# Altium project Business_card.PrjPcb
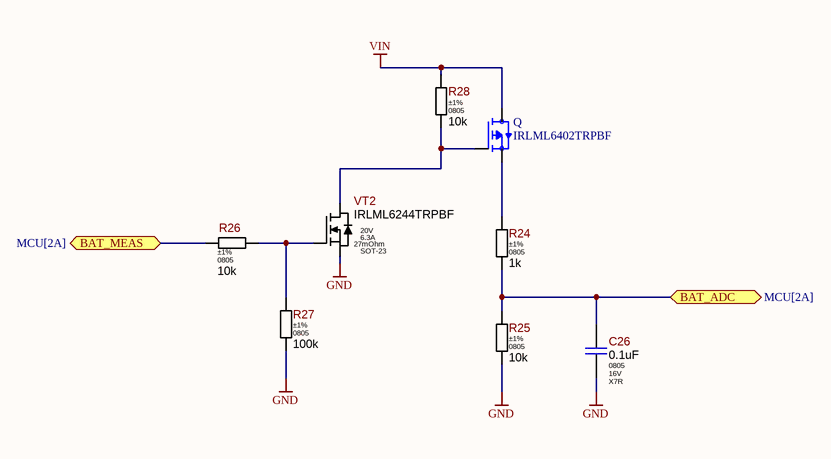
[diagram p0: BAT.SchDoc]
2 sheets, 41 parts. Net scope: flat (ports and power ports of the same name join across sheets).
Board file: PCB1.PcbDoc
Sheets:
  BAT.SchDoc
  MCU.SchDoc

## Sheet BAT.SchDoc
size A; SheetNumber: 3; SheetTotal: 4

### Parts
C26  Package: 0805  Voltage: 16V  Dielectric Type: X7R  [C0805]  (hidden comment: 0.1uF)
Q  IRLML6402TRPBF  [SOT95P237X112-3N]
R24  Tolerance: ±1%  Package: 0805  [R0805]  (hidden comment: 1k)
R25  value 10k  Tolerance: ±1%  Package: 0805  [R0805]  (hidden comment: 1M)
R26  Tolerance: ±1%  Package: 0805  [R0805]  (hidden comment: 10k)
R27  value 100k  Tolerance: ±1%  Package: 0805  [R0805]  (hidden comment: 10k)
R28  Tolerance: ±1%  Package: 0805  [R0805]  (hidden comment: 10k)
VT2  Part Number: IRLML6244TRPBF  Vds: 20V  Id: 6.3A  Rds: 27mOhm  Package: SOT-23  [IRLMT]  (hidden comment: IRLML6244)

### Ports
BAT_ADC (bidir, see MCU[2A]), BAT_MEAS (bidir, see MCU[2A])

### Nets
GND: C26.2 R25.2 R27.2 VT2.2(S)
VIN: Q.3(D) R28.1
NetC26_1: C26.1 R24.2 R25.1 ; port BAT_ADC
NetQ_1: Q.1(G) R28.2 VT2.3(D)
NetQ_2: Q.2(S) R24.1
NetR26_1: R26.1 ; port BAT_MEAS
NetR26_2: R26.2 R27.1 VT2.1(G)

### Library data of the parts
C26 = Capacitor-NonPolar: Part Number: GRM155R71C104JA88J; Manufacturer: Murata Electronics; Ajax_1C_ID: 25536; Ajax_1C_PN: 100nF 16V X7R 5% 0402 GRM155R71C104JA88J Ceramic Capacitor SMD RoHS; Standard Lead Time: 16 Weeks; Tolerance: ±5%; Replacement: NONE; Value: 0.1uF; Part Type: Ceramic / X7R / 0402; Component Type: SMD; Temperature Range: -55°C ~ 125°C; ComponentLink1URL: https://eu.mouser.com/datasheet/2/281/1/GRM155R71C104JA88_01A-1983984.pdf; Supplier 1: Mouser; Supplier Part Number 1: 81-GRM155R71C104JA8J; ComponentLink1Description: Datasheet
Q = IRLML6402TRPBF: RoHS Compliant | Industry-leading quality | Fast Switching | Low Profile _less than 1.1mm_ | P-Channel MOSFET | SOT-23 Footprint; MF: Infineon; Package: SOT-23 Infineon; Value: *; Price: None; MP: IRLML6402TRPBF; SnapEDA_Link: https://www.snapeda.com/parts/IRLML6402TRPBF/Infineon%20Technologies/view-part/523558/?ref=snap; Availability: Unavailable
R24-R28 = Resistor: 10 kOhms ±1% 1/16W 0402 Thick Film Resistor; Part Number: RC0402FR-0710KL; Manufacturer: Yageo; Ajax_1C_ID: 6717; Ajax_1C_PN: 10k 1% 0402 Resistors SMD RoHS; Power Rating: 0.062W; Voltage: 50V; Temperature Stability: ±100ppm/°C; Replacement: NONE; Component Type: SMD; Part Type: Thick Film; Temperature Range: -55°C ~ 155°C; ComponentLink1URL: https://eu.mouser.com/datasheet/2/447/PYu_RC_Group_51_RoHS_L_10-1664068.pdf; Supplier 1: Digi-Key; Supplier Part Number 1: 311-10.0KLRTR-ND; ComponentLink1Description: Datasheet
  R24: Value: 1k
  R26 R28: Value: 10k
VT2 = MOSFET-N-Channel: 20V, 6.3A max N-Channel HEXFET MOSFET, 21mOhm @ Vgs = 4.5V; Manufacturer: Infineon Technologies; Ajax_1C_ID: 5903; Ajax_1C_PN: IRLML6244TRPBF. полевой транзистор; Standard Lead Time: 15 Weeks; Replacement: NONE; Part Type: N-Channel; Component Type: SMD; Temperature Range: -55°C ~ 150°C; ComponentLink1URL: https://www.infineon.com/dgdl/irlml6244pbf.pdf?fileId=5546d462533600a4015356686fed261f; Supplier 1: Digi-Key; Supplier Part Number 1: IRLML6244TRPBFTR-ND; ComponentLink1Description: Datasheet

## Sheet MCU.SchDoc
size A; SheetNumber: 4; SheetTotal: 4
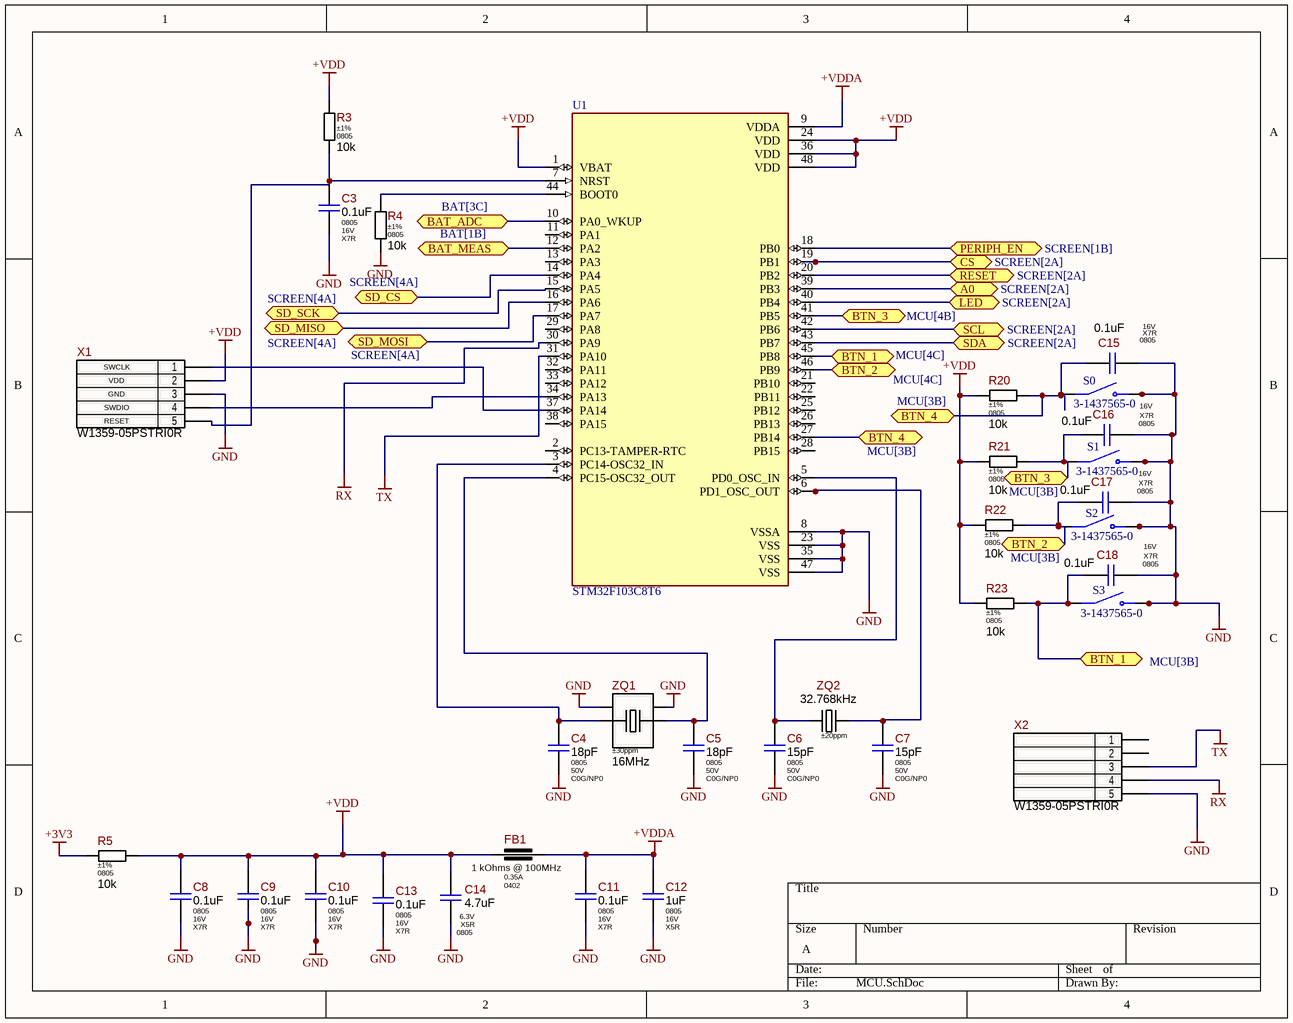
[diagram p1: MCU.SchDoc]

### Parts
C3  Package: 0805  Voltage: 16V  Dielectric Type: X7R  [C0805]  (hidden comment: 0.1uF)
C4  Package: 0805  Voltage: 50V  Dielectric Type: C0G/NP0  [C0805]  (hidden comment: 18pF)
C5  Package: 0805  Voltage: 50V  Dielectric Type: C0G/NP0  [C0805]  (hidden comment: 18pF)
C6  Package: 0805  Voltage: 50V  Dielectric Type: C0G/NP0  [C0805]  (hidden comment: 15pF)
C7  Package: 0805  Voltage: 50V  Dielectric Type: C0G/NP0  [C0805]  (hidden comment: 15pF)
C8  Package: 0805  Voltage: 16V  Dielectric Type: X7R  [C0805]  (hidden comment: 0.1uF)
C9  Package: 0805  Voltage: 16V  Dielectric Type: X7R  [C0805]  (hidden comment: 0.1uF)
C10  Package: 0805  Voltage: 16V  Dielectric Type: X7R  [C0805]  (hidden comment: 0.1uF)
C11  Package: 0805  Voltage: 16V  Dielectric Type: X7R  [C0805]  (hidden comment: 0.1uF)
C12  Package: 0805  Voltage: 16V  Dielectric Type: X5R  [C0805]  (hidden comment: 1uF)
C13  Package: 0805  Voltage: 16V  Dielectric Type: X7R  [C0805]  (hidden comment: 0.1uF)
C14  Package: 0805  Voltage: 6.3V  Dielectric Type: X5R  [C0805]  (hidden comment: 4.7uF)
C15  Package: 0805  Voltage: 16V  Dielectric Type: X7R  [C0805]  (hidden comment: 0.1uF)
C16  Package: 0805  Voltage: 16V  Dielectric Type: X7R  [C0805]  (hidden comment: 0.1uF)
C17  Package: 0805  Voltage: 16V  Dielectric Type: X7R  [C0805]  (hidden comment: 0.1uF)
C18  Package: 0805  Voltage: 16V  Dielectric Type: X7R  [C0805]  (hidden comment: 0.1uF)
FB1  value 1 kOhms @ 100MHz  Current: 0.35A  Package: 0402  [Ferrite_Beard]  (hidden comment: FB 1 kOhm)
R3  Tolerance: ±1%  Package: 0805  [R0805]  (hidden comment: 10k)
R4  Tolerance: ±1%  Package: 0805  [R0805]  (hidden comment: 10k)
R5  Tolerance: ±1%  Package: 0805  [R0805]  (hidden comment: 10k)
R20  Tolerance: ±1%  Package: 0805  [R0805]  (hidden comment: 10k)
R21  Tolerance: ±1%  Package: 0805  [R0805]  (hidden comment: 10k)
R22  Tolerance: ±1%  Package: 0805  [R0805]  (hidden comment: 10k)
R23  Tolerance: ±1%  Package: 0805  [R0805]  (hidden comment: 10k)
S0  3-1437565-0  [SW_3-1437565-0]
S1  3-1437565-0  [SW_3-1437565-0]
S2  3-1437565-0  [SW_3-1437565-0]
S3  3-1437565-0  [SW_3-1437565-0]
U1  STM32F103C8T6  [QFP50P900X900X160-48N]
X1  W1359-05PSTRI0R  [DBG_PINS]
X2  W1359-05PSTRI0R  [DBG_PINS]
ZQ1  Frequency Tolerance: ±30ppm  Frequency: 16MHz  [Crystal16Mhz]  (hidden comment: CXA-016000-3X7X40)
ZQ2  Frequency Tolerance: ±20ppm  Frequency: 32.768kHz  [Crystal32768]  (hidden comment: D31-032768-BDRD4A)

### Ports
A0 (bidir, see SCREEN[2A]), BAT_ADC (bidir, see BAT[3C]), BAT_MEAS (bidir, see BAT[1B]), BTN_1 (bidir, see MCU[3B]), BTN_1 (bidir, see MCU[4C]), BTN_2 (bidir, see MCU[3B]), BTN_2 (bidir, see MCU[4C]), BTN_3 (bidir, see MCU[3B]), BTN_3 (bidir, see MCU[4B]), BTN_4 (bidir, see MCU[3B]), CS (bidir, see SCREEN[2A]), LED (bidir, see SCREEN[2A]), PERIPH_EN (bidir, see SCREEN[1B]), RESET (bidir, see SCREEN[2A]), SCL (bidir, see SCREEN[2A]), SD_CS (bidir, see SCREEN[4A]), SD_MISO (bidir, see SCREEN[4A]), SD_MOSI (bidir, see SCREEN[4A]), SD_SCK (bidir, see SCREEN[4A]), SDA (bidir, see SCREEN[2A])

### Nets
+3V3: R5.1
+VDD: C8.1 C9.1 C10.1 C13.1 C14.1 FB1.2 R3.1 R5.2 R20.1 R21.1 R22.1 R23.1 U1.1(VBAT) U1.24(VDD) U1.36(VDD) U1.48(VDD) X1.2
+VDDA: C11.1 C12.1 FB1.1 U1.9(VDDA)
GND: C3.2 C4.2 C5.2 C6.2 C7.2 C8.2 C9.2 C10.2 C11.2 C12.2 C13.2 C14.2 C15.2 C16.2 C17.2 C18.2 R4.2 S0.3(NO) S0.4(NO) S1.3(NO) S1.4(NO) S2.3(NO) S2.4(NO) S3.3(NO) S3.4(NO) U1.8(VSSA) U1.23(VSS) U1.35(VSS) U1.47(VSS) X1.3 X2.5 ZQ1.2(NC1) ZQ1.4(NC2)
RX: U1.30(PA9) X2.4
TX: U1.31(PA10) X2.3
NetC3_1: C3.1 R3.2 U1.7(NRST) X1.5
NetC4_1: C4.1 U1.3(PC14-OSC32_IN) ZQ1.1(XTAL1)
NetC5_1: C5.1 U1.4(PC15-OSC32_OUT) ZQ1.3(XTAL2)
NetC6_1: C6.1 U1.5(PD0_OSC_IN) ZQ2.1(XTAL1)
NetC7_1: C7.1 U1.6(PD1_OSC_OUT) ZQ2.2(XTAL2)
NetC15_1: C15.1 R20.2 S0.1(COM) S0.2(COM) U1.27(PB14) ; port BTN_4
NetC16_1: C16.1 R21.2 S1.1(COM) S1.2(COM) U1.41(PB5) ; port BTN_3
NetC17_1: C17.1 R22.2 S2.1(COM) S2.2(COM) U1.46(PB9) ; port BTN_2
NetC18_1: C18.1 R23.2 S3.1(COM) S3.2(COM) U1.45(PB8) ; port BTN_1
NetC26_1: U1.10(PA0_WKUP) ; port BAT_ADC
NetR4_1: R4.1 U1.44(BOOT0)
NetR26_1: U1.12(PA2) ; port BAT_MEAS
NetU1_14: U1.14(PA4) ; port SD_CS
NetU1_15: U1.15(PA5) ; port SD_SCK
NetU1_16: U1.16(PA6) ; port SD_MISO
NetU1_17: U1.17(PA7) ; port SD_MOSI
NetU1_18: U1.18(PB0) ; port PERIPH_EN
NetU1_19: U1.19(PB1) ; port CS
NetU1_20: U1.20(PB2) ; port RESET
NetU1_34: U1.34(PA13) X1.4
NetU1_37: U1.37(PA14) X1.1
NetU1_39: U1.39(PB3) ; port A0
NetU1_40: U1.40(PB4) ; port LED
NetU1_42: U1.42(PB6) ; port SCL
NetU1_43: U1.43(PB7) ; port SDA

Not connected (* = marked no-connect by the designer): U1 2(PC13-TAMPER-RTC) 11(PA1) 13(PA3) 21(PB10) 22(PB11) 25(PB12) 26(PB13) 28(PB15) 29(PA8) 32(PA11) 33(PA12) 38(PA15); X2 1 2

### Notes on the sheet
- SWCLK
- RESET
- GND
- VDD
- SWDIO

### Library data of the parts
C3 C8-C11 C13 C15-C18 = Capacitor-NonPolar: as C26 on sheet BAT; Value: 0.1uF; Part Type: Ceramic / X7R / 0402; Component Type: SMD; Temperature Range: -55°C ~ 125°C; ComponentLink1URL: https://eu.mouser.com/datasheet/2/281/1/GRM155R71C104JA88_01A-1983984.pdf; Supplier 1: Mouser; Supplier Part Number 1: 81-GRM155R71C104JA8J; ComponentLink1Description: Datasheet
C4 = GRM1555C1H180JA01D: 18pF 50V C0G ±5% 0402 Ceramic Capacitor RoHS; Manufacturer: Murata Electronics; Ajax_1C_ID: 6280; Ajax_1C_PN: 18pF 50V COG 5% 0402 GRM1555C1H180JA01D Murata Ceramic Capacitor SMD RoHS; Standard Lead Time: 15 Weeks; Replacement: GRM1555C1H180JA01J; Value: 18pF; Part Number: GRM1555C1H180JA01D; Part Type: Ceramic / C0G(NP0) / 0402; Component Type: SMD; Temperature Range: -55°C ~ 125°C; Tolerance: ±5%; ComponentLink1URL: https://search.murata.co.jp/Ceramy/image/img/A01X/G101/ENG/GRM1555C1H180JA01-01.pdf; Supplier 1: Digi-Key; Supplier Part Number 1: 490-5858-2-ND; ComponentLink1Description: Datasheet
C5 = Capacitor-NonPolar: Part Number: GRM1555C1H180JA01D; Manufacturer: Murata Electronics; Ajax_1C_ID: 6280; Ajax_1C_PN: 18pF 50V COG 5% 0402 GRM1555C1H180JA01D Murata Ceramic Capacitor SMD RoHS; Standard Lead Time: 15 Weeks; Tolerance: ±5%; Replacement: GRM1555C1H180JA01J; Value: 18pF; Part Type: Ceramic / C0G(NP0) / 0402; Component Type: SMD; Temperature Range: -55°C ~ 125°C; ComponentLink1URL: https://search.murata.co.jp/Ceramy/image/img/A01X/G101/ENG/GRM1555C1H180JA01-01.pdf; Supplier 1: Digi-Key; Supplier Part Number 1: 490-5858-2-ND; ComponentLink1Description: Datasheet
C6 = Capacitor-NonPolar: Part Number: GRM1555C1H150FA01D; Manufacturer: Murata Electronics; Ajax_1C_ID: 7139; Ajax_1C_PN: 15pF 50V COG 1% 0402 Murata GRM1555C1H150FA01D Ceramic Capacitor SMD RoHS; Standard Lead Time: 15 Weeks; Tolerance: ±1%; Replacement: NONE; Value: 15pF; Part Type: Ceramic / C0G(NP0) / 0402; Component Type: SMD; Temperature Range: -55°C ~ 125°C; ComponentLink1URL: https://search.murata.co.jp/Ceramy/image/img/A01X/G101/ENG/GRM1555C1H150FA01-01.pdf; Supplier 1: Digi-Key; Supplier Part Number 1: 490-6200-2-ND; ComponentLink1Description: Datasheet
C7 = GRM1555C1H150FA01D: 15pF 50V C0G ±1% 0402 Ceramic Capacitor RoHS; Manufacturer: Murata Electronics; Ajax_1C_ID: 7139; Ajax_1C_PN: 15pF 50V COG 1% 0402 Murata GRM1555C1H150FA01D Ceramic Capacitor SMD RoHS; Standard Lead Time: 15 Weeks; Replacement: NONE; Value: 15pF; Part Number: GRM1555C1H150FA01D; Part Type: Ceramic / C0G(NP0) / 0402; Component Type: SMD; Temperature Range: -55°C ~ 125°C; Tolerance: ±1%; ComponentLink1URL: https://search.murata.co.jp/Ceramy/image/img/A01X/G101/ENG/GRM1555C1H150FA01-01.pdf; Supplier 1: Digi-Key; Supplier Part Number 1: 490-6200-2-ND; ComponentLink1Description: Datasheet
C12 = Capacitor-NonPolar: Part Number: CL05A105KO5NNNC; Manufacturer: Samsung Electro-Mechanics; Ajax_1C_ID: 11400; Ajax_1C_PN: 1uF 16V Х5R 10% 0402 Samsung CL05A105KO5NNNC Ceramic Capacitor SMD RoHS; Standard Lead Time: 28 Weeks; Tolerance: ±10%; Replacement: NONE; Value: 1uF; Part Type: Ceramic / X5R / 0402; Component Type: SMD; Temperature Range: -55°C ~ 85°C; ComponentLink1URL: https://media.digikey.com/pdf/Data%20Sheets/Samsung%20PDFs/CL_Series_MLCC_ds.pdf; Supplier 1: Digi-Key; Supplier Part Number 1: 1276-1067-2-ND; ComponentLink1Description: Datasheet
C14 = Capacitor-NonPolar: Part Number: GRM155R60J475ME47; Manufacturer: Murata Electronics; Ajax_1C_ID: 9721; Ajax_1C_PN: 4.7uF 6.3V X5R 20% 0402 GRM155R60J475ME47D Ceramic Capacitor SMD RoHS; Standard Lead Time: 15 Weeks; Tolerance: ±20%; Replacement: CC0402MRX5R5BB475; Value: 4.7uF; Part Type: Ceramic / X5R / 0402; Component Type: SMD; Temperature Range: -55°C ~ 85°C; ComponentLink1URL: https://search.murata.co.jp/Ceramy/image/img/A01X/G101/ENG/GRM155R60J475ME47-01.pdf; Supplier 1: Digi-Key; Supplier Part Number 1: 490-5915-2-ND; ComponentLink1Description: Datasheet
FB1 = BLM15AX102SN1D: 1 kOhms @ 100MHz Ferrite Bead 0402, 350mA 490mOhm; Manufacturer: Murata Electronics; Ajax_1C_ID: 4296; Ajax_1C_PN: 1 kOhm 25% 0.35A 100MHz 0402 Murata BLM15AX102SN1D SMD Ferrite bead; Saturation Current: NONE; Tolerance: ±25%; Standard Lead Time: 7 Weeks; Part Number: BLM15AX102SN1D; Part Type: Ferrite Bead; Component Type: SMD; Temperature Range: -55°C ~ 125°C; ComponentLink1URL: https://www.murata.com/en-us/products/productdata/8796740059166/ENFA0018.pdf; Supplier 1: Digi-Key; Supplier Part Number 1: 490-5442-2-ND; Replacement: NONE; ComponentLink1Description: Datasheet
R3-R5 R20-R23 = Resistor: as R24 on sheet BAT; Value: 10k; Component Type: SMD; Part Type: Thick Film; Temperature Range: -55°C ~ 155°C; ComponentLink1URL: https://eu.mouser.com/datasheet/2/447/PYu_RC_Group_51_RoHS_L_10-1664068.pdf; Supplier 1: Digi-Key; Supplier Part Number 1: 311-10.0KLRTR-ND; ComponentLink1Description: Datasheet
S0-S3 = 3-1437565-0: Switch Tactile OFF (ON) SPST Round Button Gull Wing 0.05A 24VDC 1VA 9.18N SMD T/R; MF: TE Connectivity; MP: 3-1437565-0; Package: SMD-6 Omron Electronics; Purchase-URL: https://pricing.snapeda.com/search/part/3-1437565-0/?ref=eda; Price: None; Value: *; SnapEDA_Link: https://www.snapeda.com/parts/3-1437565-0/TE%20Connectivity/view-part/294084/?ref=snap; Availability: Good
U1 = STM32F103C8T6: ARM® Cortex®-M3 STM32F1 Microcontroller IC 32-Bit 72MHz 64KB (64K x 8) FLASH 48-LQFP (7x7); MF: STMicroelectronics; SnapEDA_Link: https://www.snapeda.com/parts/STM32F103C8T6/STMicroelectronics/view-part/?ref=snap; Package: LQFP-48 STMicroelectronics; Value: *; MP: STM32F103C8T6; Check_prices: https://www.snapeda.com/parts/STM32F103C8T6/STMicroelectronics/view-part/?ref=eda
X1 X2 = General-5-Pin: 1.25mm Wire-to-Board Header, Vertical, PTH, 5 pin; Manufacturer: Hsuan Mao Technology; Ajax_1C_ID: 46764; Ajax_1C_PN: Разъём W1359-05PSTRI0R - 5pin THT Straight; Replacement: 53047-0510; Part Number: W1359-05PSTRI0R; Part Type: Wire-to-Board / 1.25mm; Component Type: PTH; Temperature Range: -40°C ~ 85°C; ComponentLink1URL: \\altiumdb.ajax.local\files\Datasheet\Connectors\W1359-XXPST0I0R(S77).pdf; ComponentLink1Description: Datasheet
ZQ1 = Crystal-Quartz-4-Pin-01: Manufacturer: Aker; Ajax_1C_ID: 25572; Ajax_1C_PN: 16.000MHz 12pF ±30/30 ppm 3.2x2.5mm AKER CXA-016000-3X7X40 SMD кварц; Load Capacitance: 12pF; Standard Lead Time: NONE; Part Number: CXA-016000-3X7X40; Part Type: Crystal; Component Type: SMD; Frequency Stability: ±30ppm; Temperature Range: -40°C ~ 85 °C; ComponentLink1URL: \\altiumdb.ajax.local\files\Datasheet\Oscillators\CXA-016000-3X7X40.pdf; Replacement: NONE; ComponentLink1Description: Datasheet
ZQ2 = D31-032768-BDRD4A: 32.768kHz 12.5pF ±20ppm, 0.5uW DL Crystal Quartz; Manufacturer: Aker; Ajax_1C_ID: 19913; Ajax_1C_PN: 32.768KHz 20ppm 12.5pf 3.2x1.5 mm SMD D31-032768-BDRD4A SEIKO кварц; Frequency Stability: NONE; Part Number: D31-032768-BDRD4A; Part Type: Crystal; Component Type: SMD; Load Capacitance: 12.5pF; Temperature Range: -40°C ~ 85 °C; Standard Lead Time: NONE; ComponentLink1URL: \\altiumdb.ajax.local\files\Datasheet\Oscillators\D31-032768-BDRD4A_Seiko.pdf; Replacement: NONE; ComponentLink1Description: Datasheet

## Nets that join several sheets
GND: BAT (C26.2 R25.2 R27.2 VT2.2), MCU (33 pins)
NetC26_1: BAT (C26.1 R24.2 R25.1), MCU (U1.10)
NetR26_1: BAT (R26.1), MCU (U1.12)